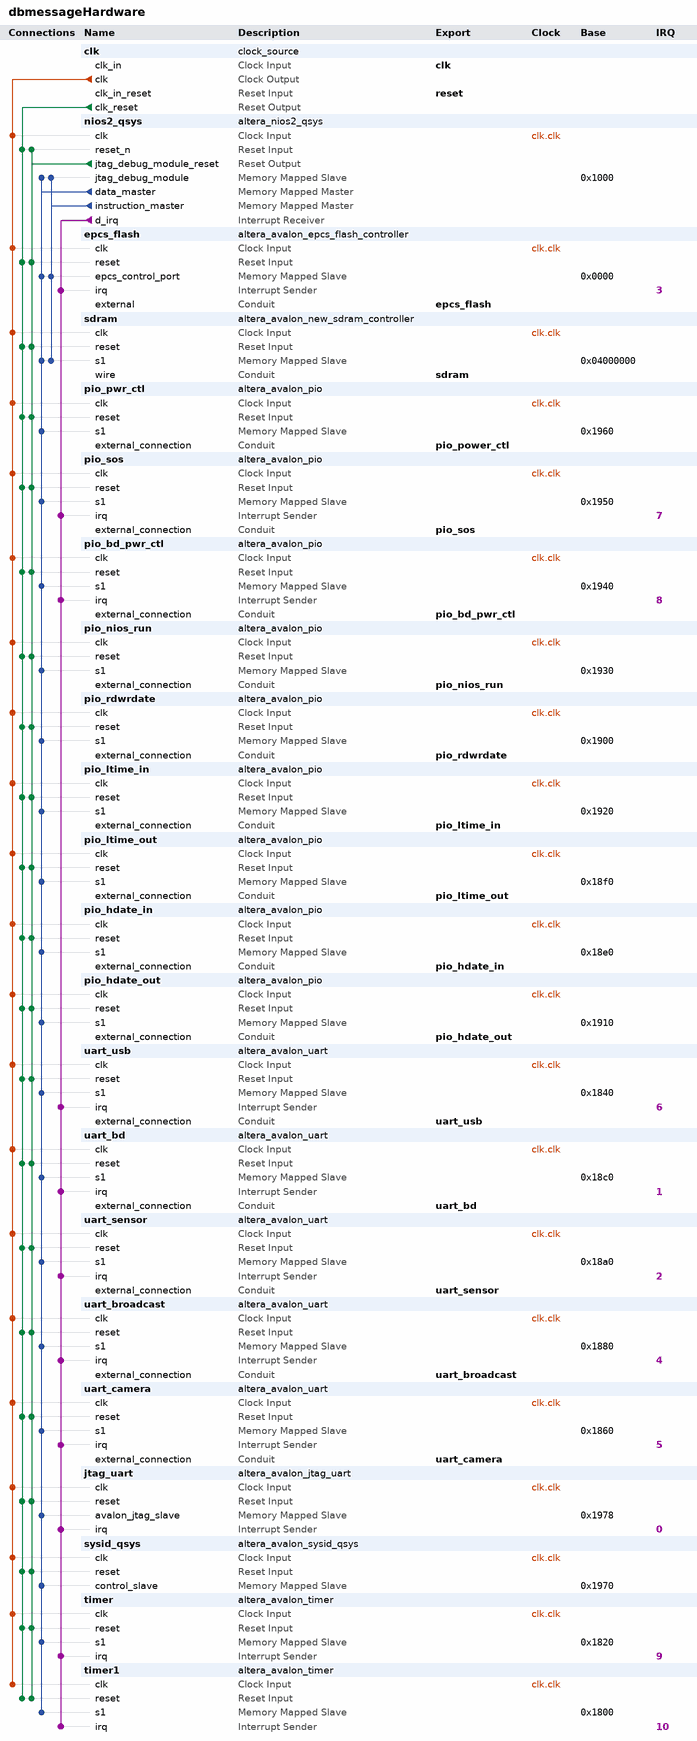
[diagram p0: system contents]
# Platform Designer (Qsys) system dbmessageHardware, Cyclone IV E EP4CE10F17C8
# Parameters at their usual value, and those the tool derives, are not listed.
package require -exact qsys 13.1
create_system dbmessageHardware
set_project_property DEVICE_FAMILY {Cyclone IV E}
set_project_property DEVICE EP4CE10F17C8

add_instance clk clock_source 13.1
set_instance_parameter_value clk clockFrequency 100000000

add_instance nios2_qsys altera_nios2_qsys 13.1
set_instance_parameter_value nios2_qsys muldiv_divider true
set_instance_parameter_value nios2_qsys resetSlave epcs_flash.epcs_control_port
set_instance_parameter_value nios2_qsys mmu_TLBMissExcSlave None
set_instance_parameter_value nios2_qsys exceptionSlave sdram.s1
set_instance_parameter_value nios2_qsys breakSlave nios2_qsys.jtag_debug_module
set_instance_parameter_value nios2_qsys impl Fast
set_instance_parameter_value nios2_qsys icache_size 4096

add_instance epcs_flash altera_avalon_epcs_flash_controller 13.1

add_instance sdram altera_avalon_new_sdram_controller 13.1
set_instance_parameter_value sdram TAC 6.0
set_instance_parameter_value sdram TRCD 20.0
set_instance_parameter_value sdram TRFC 60.0
set_instance_parameter_value sdram TRP 40.0
set_instance_parameter_value sdram TWR 20.0
set_instance_parameter_value sdram casLatency 2
set_instance_parameter_value sdram columnWidth 9
set_instance_parameter_value sdram dataWidth 16
set_instance_parameter_value sdram generateSimulationModel false
set_instance_parameter_value sdram initRefreshCommands 8
set_instance_parameter_value sdram model single_Micron_MT48LC4M32B2_7_chip
set_instance_parameter_value sdram numberOfBanks 4
set_instance_parameter_value sdram numberOfChipSelects 1
set_instance_parameter_value sdram powerUpDelay 200.0
set_instance_parameter_value sdram refreshPeriod 7.8125
set_instance_parameter_value sdram rowWidth 13

add_instance pio_pwr_ctl altera_avalon_pio 13.1
set_instance_parameter_value pio_pwr_ctl direction Output
set_instance_parameter_value pio_pwr_ctl generateIRQ true
set_instance_parameter_value pio_pwr_ctl resetValue 255
set_instance_parameter_value pio_pwr_ctl width 8

add_instance pio_sos altera_avalon_pio 13.1
set_instance_parameter_value pio_sos bitClearingEdgeCapReg true
set_instance_parameter_value pio_sos captureEdge true
set_instance_parameter_value pio_sos direction Input
set_instance_parameter_value pio_sos generateIRQ true
set_instance_parameter_value pio_sos irqType EDGE
set_instance_parameter_value pio_sos width 1

add_instance pio_bd_pwr_ctl altera_avalon_pio 13.1
set_instance_parameter_value pio_bd_pwr_ctl captureEdge true
set_instance_parameter_value pio_bd_pwr_ctl direction Input
set_instance_parameter_value pio_bd_pwr_ctl generateIRQ true
set_instance_parameter_value pio_bd_pwr_ctl irqType EDGE
set_instance_parameter_value pio_bd_pwr_ctl width 1

add_instance pio_nios_run altera_avalon_pio 13.1
set_instance_parameter_value pio_nios_run direction Output
set_instance_parameter_value pio_nios_run generateIRQ true
set_instance_parameter_value pio_nios_run width 1

add_instance pio_rdwrdate altera_avalon_pio 13.1
set_instance_parameter_value pio_rdwrdate direction Output
set_instance_parameter_value pio_rdwrdate width 2

add_instance pio_ltime_in altera_avalon_pio 13.1
set_instance_parameter_value pio_ltime_in direction Input
set_instance_parameter_value pio_ltime_in width 24

add_instance pio_ltime_out altera_avalon_pio 13.1
set_instance_parameter_value pio_ltime_out direction Output
set_instance_parameter_value pio_ltime_out width 24

add_instance pio_hdate_in altera_avalon_pio 13.1
set_instance_parameter_value pio_hdate_in direction Input
set_instance_parameter_value pio_hdate_in width 24

add_instance pio_hdate_out altera_avalon_pio 13.1
set_instance_parameter_value pio_hdate_out direction Output
set_instance_parameter_value pio_hdate_out width 24

add_instance uart_usb altera_avalon_uart 13.1
set_instance_parameter_value uart_usb baud 115200
set_instance_parameter_value uart_usb dataBits 8
set_instance_parameter_value uart_usb fixedBaud false
set_instance_parameter_value uart_usb parity NONE
set_instance_parameter_value uart_usb stopBits 1
set_instance_parameter_value uart_usb useEopRegister true

add_instance uart_bd altera_avalon_uart 13.1
set_instance_parameter_value uart_bd baud 115200
set_instance_parameter_value uart_bd dataBits 8
set_instance_parameter_value uart_bd fixedBaud false
set_instance_parameter_value uart_bd parity NONE
set_instance_parameter_value uart_bd stopBits 1
set_instance_parameter_value uart_bd useEopRegister true

add_instance uart_sensor altera_avalon_uart 13.1
set_instance_parameter_value uart_sensor baud 9600
set_instance_parameter_value uart_sensor dataBits 8
set_instance_parameter_value uart_sensor fixedBaud false
set_instance_parameter_value uart_sensor parity NONE
set_instance_parameter_value uart_sensor stopBits 1

add_instance uart_broadcast altera_avalon_uart 13.1
set_instance_parameter_value uart_broadcast baud 115200
set_instance_parameter_value uart_broadcast dataBits 8
set_instance_parameter_value uart_broadcast fixedBaud false
set_instance_parameter_value uart_broadcast parity NONE
set_instance_parameter_value uart_broadcast stopBits 1

add_instance uart_camera altera_avalon_uart 13.1
set_instance_parameter_value uart_camera baud 115200
set_instance_parameter_value uart_camera dataBits 8
set_instance_parameter_value uart_camera fixedBaud false
set_instance_parameter_value uart_camera parity NONE
set_instance_parameter_value uart_camera stopBits 1

add_instance jtag_uart altera_avalon_jtag_uart 13.1
set_instance_parameter_value jtag_uart simInteractiveOptions NO_INTERACTIVE_WINDOWS

add_instance sysid_qsys altera_avalon_sysid_qsys 13.1
set_instance_parameter_value sysid_qsys id 0

add_instance timer altera_avalon_timer 13.1
set_instance_parameter_value timer period 1
set_instance_parameter_value timer periodUnits MSEC

add_instance timer1 altera_avalon_timer 13.1
set_instance_parameter_value timer1 period 1
set_instance_parameter_value timer1 periodUnits MSEC

# connections
add_connection clk.clk epcs_flash.clk clock
add_connection clk.clk jtag_uart.clk clock
add_connection clk.clk nios2_qsys.clk clock
add_connection clk.clk pio_bd_pwr_ctl.clk clock
add_connection clk.clk pio_hdate_in.clk clock
add_connection clk.clk pio_hdate_out.clk clock
add_connection clk.clk pio_ltime_in.clk clock
add_connection clk.clk pio_ltime_out.clk clock
add_connection clk.clk pio_nios_run.clk clock
add_connection clk.clk pio_pwr_ctl.clk clock
add_connection clk.clk pio_rdwrdate.clk clock
add_connection clk.clk pio_sos.clk clock
add_connection clk.clk sdram.clk clock
add_connection clk.clk sysid_qsys.clk clock
add_connection clk.clk timer1.clk clock
add_connection clk.clk timer.clk clock
add_connection clk.clk uart_bd.clk clock
add_connection clk.clk uart_broadcast.clk clock
add_connection clk.clk uart_camera.clk clock
add_connection clk.clk uart_sensor.clk clock
add_connection clk.clk uart_usb.clk clock
add_connection clk.clk_reset epcs_flash.reset reset
add_connection clk.clk_reset jtag_uart.reset reset
add_connection clk.clk_reset nios2_qsys.reset_n reset
add_connection clk.clk_reset pio_bd_pwr_ctl.reset reset
add_connection clk.clk_reset pio_hdate_in.reset reset
add_connection clk.clk_reset pio_hdate_out.reset reset
add_connection clk.clk_reset pio_ltime_in.reset reset
add_connection clk.clk_reset pio_ltime_out.reset reset
add_connection clk.clk_reset pio_nios_run.reset reset
add_connection clk.clk_reset pio_pwr_ctl.reset reset
add_connection clk.clk_reset pio_rdwrdate.reset reset
add_connection clk.clk_reset pio_sos.reset reset
add_connection clk.clk_reset sdram.reset reset
add_connection clk.clk_reset sysid_qsys.reset reset
add_connection clk.clk_reset timer1.reset reset
add_connection clk.clk_reset timer.reset reset
add_connection clk.clk_reset uart_bd.reset reset
add_connection clk.clk_reset uart_broadcast.reset reset
add_connection clk.clk_reset uart_camera.reset reset
add_connection clk.clk_reset uart_sensor.reset reset
add_connection clk.clk_reset uart_usb.reset reset
add_connection nios2_qsys.jtag_debug_module_reset epcs_flash.reset reset
add_connection nios2_qsys.jtag_debug_module_reset jtag_uart.reset reset
add_connection nios2_qsys.jtag_debug_module_reset nios2_qsys.reset_n reset
add_connection nios2_qsys.jtag_debug_module_reset pio_bd_pwr_ctl.reset reset
add_connection nios2_qsys.jtag_debug_module_reset pio_hdate_in.reset reset
add_connection nios2_qsys.jtag_debug_module_reset pio_hdate_out.reset reset
add_connection nios2_qsys.jtag_debug_module_reset pio_ltime_in.reset reset
add_connection nios2_qsys.jtag_debug_module_reset pio_ltime_out.reset reset
add_connection nios2_qsys.jtag_debug_module_reset pio_nios_run.reset reset
add_connection nios2_qsys.jtag_debug_module_reset pio_pwr_ctl.reset reset
add_connection nios2_qsys.jtag_debug_module_reset pio_rdwrdate.reset reset
add_connection nios2_qsys.jtag_debug_module_reset pio_sos.reset reset
add_connection nios2_qsys.jtag_debug_module_reset sdram.reset reset
add_connection nios2_qsys.jtag_debug_module_reset sysid_qsys.reset reset
add_connection nios2_qsys.jtag_debug_module_reset timer1.reset reset
add_connection nios2_qsys.jtag_debug_module_reset timer.reset reset
add_connection nios2_qsys.jtag_debug_module_reset uart_bd.reset reset
add_connection nios2_qsys.jtag_debug_module_reset uart_broadcast.reset reset
add_connection nios2_qsys.jtag_debug_module_reset uart_camera.reset reset
add_connection nios2_qsys.jtag_debug_module_reset uart_sensor.reset reset
add_connection nios2_qsys.jtag_debug_module_reset uart_usb.reset reset
add_connection nios2_qsys.data_master epcs_flash.epcs_control_port avalon
set_connection_parameter_value nios2_qsys.data_master/epcs_flash.epcs_control_port baseAddress 0x0000
add_connection nios2_qsys.data_master jtag_uart.avalon_jtag_slave avalon
set_connection_parameter_value nios2_qsys.data_master/jtag_uart.avalon_jtag_slave baseAddress 0x1978
add_connection nios2_qsys.data_master nios2_qsys.jtag_debug_module avalon
set_connection_parameter_value nios2_qsys.data_master/nios2_qsys.jtag_debug_module baseAddress 0x1000
add_connection nios2_qsys.data_master pio_bd_pwr_ctl.s1 avalon
set_connection_parameter_value nios2_qsys.data_master/pio_bd_pwr_ctl.s1 baseAddress 0x1940
add_connection nios2_qsys.data_master pio_hdate_in.s1 avalon
set_connection_parameter_value nios2_qsys.data_master/pio_hdate_in.s1 baseAddress 0x18e0
add_connection nios2_qsys.data_master pio_hdate_out.s1 avalon
set_connection_parameter_value nios2_qsys.data_master/pio_hdate_out.s1 baseAddress 0x1910
add_connection nios2_qsys.data_master pio_ltime_in.s1 avalon
set_connection_parameter_value nios2_qsys.data_master/pio_ltime_in.s1 baseAddress 0x1920
add_connection nios2_qsys.data_master pio_ltime_out.s1 avalon
set_connection_parameter_value nios2_qsys.data_master/pio_ltime_out.s1 baseAddress 0x18f0
add_connection nios2_qsys.data_master pio_nios_run.s1 avalon
set_connection_parameter_value nios2_qsys.data_master/pio_nios_run.s1 baseAddress 0x1930
add_connection nios2_qsys.data_master pio_pwr_ctl.s1 avalon
set_connection_parameter_value nios2_qsys.data_master/pio_pwr_ctl.s1 baseAddress 0x1960
add_connection nios2_qsys.data_master pio_rdwrdate.s1 avalon
set_connection_parameter_value nios2_qsys.data_master/pio_rdwrdate.s1 baseAddress 0x1900
add_connection nios2_qsys.data_master pio_sos.s1 avalon
set_connection_parameter_value nios2_qsys.data_master/pio_sos.s1 baseAddress 0x1950
add_connection nios2_qsys.data_master sdram.s1 avalon
set_connection_parameter_value nios2_qsys.data_master/sdram.s1 baseAddress 0x04000000
add_connection nios2_qsys.data_master sysid_qsys.control_slave avalon
set_connection_parameter_value nios2_qsys.data_master/sysid_qsys.control_slave baseAddress 0x1970
add_connection nios2_qsys.data_master timer1.s1 avalon
set_connection_parameter_value nios2_qsys.data_master/timer1.s1 baseAddress 0x1800
add_connection nios2_qsys.data_master timer.s1 avalon
set_connection_parameter_value nios2_qsys.data_master/timer.s1 baseAddress 0x1820
add_connection nios2_qsys.data_master uart_bd.s1 avalon
set_connection_parameter_value nios2_qsys.data_master/uart_bd.s1 baseAddress 0x18c0
add_connection nios2_qsys.data_master uart_broadcast.s1 avalon
set_connection_parameter_value nios2_qsys.data_master/uart_broadcast.s1 baseAddress 0x1880
add_connection nios2_qsys.data_master uart_camera.s1 avalon
set_connection_parameter_value nios2_qsys.data_master/uart_camera.s1 baseAddress 0x1860
add_connection nios2_qsys.data_master uart_sensor.s1 avalon
set_connection_parameter_value nios2_qsys.data_master/uart_sensor.s1 baseAddress 0x18a0
add_connection nios2_qsys.data_master uart_usb.s1 avalon
set_connection_parameter_value nios2_qsys.data_master/uart_usb.s1 baseAddress 0x1840
add_connection nios2_qsys.instruction_master epcs_flash.epcs_control_port avalon
set_connection_parameter_value nios2_qsys.instruction_master/epcs_flash.epcs_control_port baseAddress 0x0000
add_connection nios2_qsys.instruction_master nios2_qsys.jtag_debug_module avalon
set_connection_parameter_value nios2_qsys.instruction_master/nios2_qsys.jtag_debug_module baseAddress 0x1000
add_connection nios2_qsys.instruction_master sdram.s1 avalon
set_connection_parameter_value nios2_qsys.instruction_master/sdram.s1 baseAddress 0x04000000
add_connection nios2_qsys.d_irq epcs_flash.irq interrupt
set_connection_parameter_value nios2_qsys.d_irq/epcs_flash.irq irqNumber 3
add_connection nios2_qsys.d_irq jtag_uart.irq interrupt
set_connection_parameter_value nios2_qsys.d_irq/jtag_uart.irq irqNumber 0
add_connection nios2_qsys.d_irq pio_bd_pwr_ctl.irq interrupt
set_connection_parameter_value nios2_qsys.d_irq/pio_bd_pwr_ctl.irq irqNumber 8
add_connection nios2_qsys.d_irq pio_sos.irq interrupt
set_connection_parameter_value nios2_qsys.d_irq/pio_sos.irq irqNumber 7
add_connection nios2_qsys.d_irq timer1.irq interrupt
set_connection_parameter_value nios2_qsys.d_irq/timer1.irq irqNumber 10
add_connection nios2_qsys.d_irq timer.irq interrupt
set_connection_parameter_value nios2_qsys.d_irq/timer.irq irqNumber 9
add_connection nios2_qsys.d_irq uart_bd.irq interrupt
set_connection_parameter_value nios2_qsys.d_irq/uart_bd.irq irqNumber 1
add_connection nios2_qsys.d_irq uart_broadcast.irq interrupt
set_connection_parameter_value nios2_qsys.d_irq/uart_broadcast.irq irqNumber 4
add_connection nios2_qsys.d_irq uart_camera.irq interrupt
set_connection_parameter_value nios2_qsys.d_irq/uart_camera.irq irqNumber 5
add_connection nios2_qsys.d_irq uart_sensor.irq interrupt
set_connection_parameter_value nios2_qsys.d_irq/uart_sensor.irq irqNumber 2
add_connection nios2_qsys.d_irq uart_usb.irq interrupt
set_connection_parameter_value nios2_qsys.d_irq/uart_usb.irq irqNumber 6

# exported interfaces
add_interface clk clock sink
set_interface_property clk EXPORT_OF clk.clk_in
add_interface reset reset sink
set_interface_property reset EXPORT_OF clk.clk_in_reset
add_interface uart_bd conduit end
set_interface_property uart_bd EXPORT_OF uart_bd.external_connection
add_interface uart_sensor conduit end
set_interface_property uart_sensor EXPORT_OF uart_sensor.external_connection
add_interface sdram conduit end
set_interface_property sdram EXPORT_OF sdram.wire
add_interface epcs_flash conduit end
set_interface_property epcs_flash EXPORT_OF epcs_flash.external
add_interface uart_broadcast conduit end
set_interface_property uart_broadcast EXPORT_OF uart_broadcast.external_connection
add_interface uart_camera conduit end
set_interface_property uart_camera EXPORT_OF uart_camera.external_connection
add_interface uart_usb conduit end
set_interface_property uart_usb EXPORT_OF uart_usb.external_connection
add_interface pio_power_ctl conduit end
set_interface_property pio_power_ctl EXPORT_OF pio_pwr_ctl.external_connection
add_interface pio_sos conduit end
set_interface_property pio_sos EXPORT_OF pio_sos.external_connection
add_interface pio_bd_pwr_ctl conduit end
set_interface_property pio_bd_pwr_ctl EXPORT_OF pio_bd_pwr_ctl.external_connection
add_interface pio_nios_run conduit end
set_interface_property pio_nios_run EXPORT_OF pio_nios_run.external_connection
add_interface pio_ltime_in conduit end
set_interface_property pio_ltime_in EXPORT_OF pio_ltime_in.external_connection
add_interface pio_hdate_out conduit end
set_interface_property pio_hdate_out EXPORT_OF pio_hdate_out.external_connection
add_interface pio_rdwrdate conduit end
set_interface_property pio_rdwrdate EXPORT_OF pio_rdwrdate.external_connection
add_interface pio_ltime_out conduit end
set_interface_property pio_ltime_out EXPORT_OF pio_ltime_out.external_connection
add_interface pio_hdate_in conduit end
set_interface_property pio_hdate_in EXPORT_OF pio_hdate_in.external_connection

set_interconnect_requirement {$system} qsys_mm.clockCrossingAdapter HANDSHAKE
set_interconnect_requirement {$system} qsys_mm.maxAdditionalLatency 1
set_interconnect_requirement {$system} qsys_mm.insertDefaultSlave false

save_system dbmessageHardware.qsys
